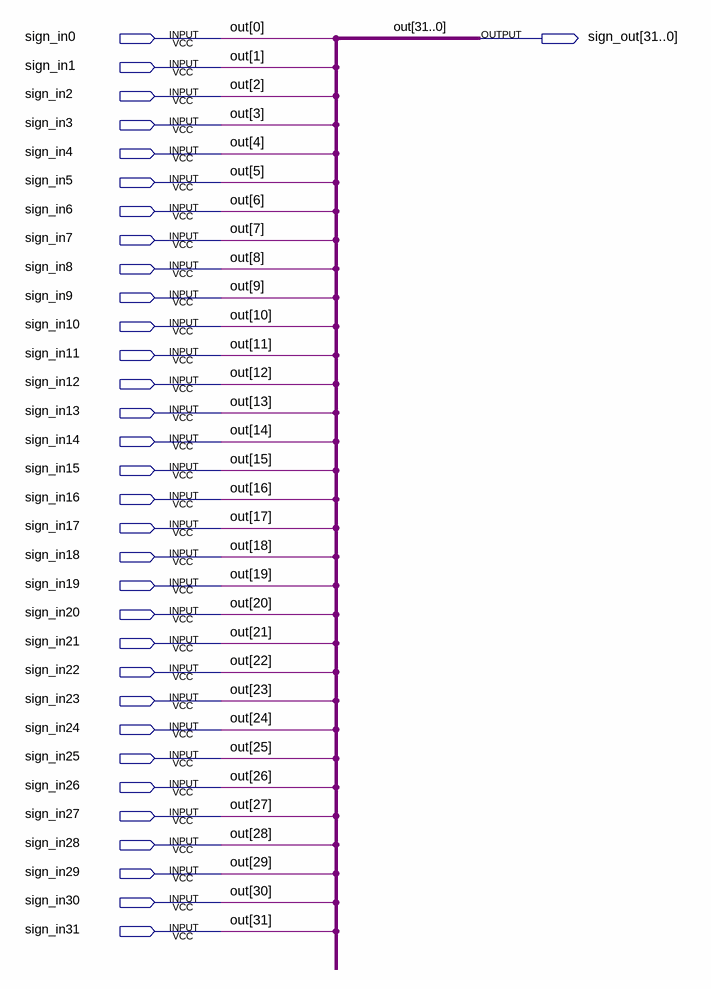
[diagram p0: schematic sheet]
// Quartus schematic sign_ext_helper2.bdf as structural Verilog: 0 symbols, 33 pins
module sign_ext_helper2 (
  input  sign_in0,
  input  sign_in1,
  input  sign_in2,
  input  sign_in3,
  input  sign_in4,
  input  sign_in5,
  input  sign_in6,
  input  sign_in7,
  input  sign_in8,
  input  sign_in9,
  input  sign_in10,
  input  sign_in11,
  input  sign_in12,
  input  sign_in13,
  input  sign_in14,
  input  sign_in15,
  input  sign_in16,
  input  sign_in17,
  input  sign_in18,
  input  sign_in19,
  input  sign_in20,
  input  sign_in21,
  input  sign_in22,
  input  sign_in23,
  input  sign_in24,
  input  sign_in25,
  input  sign_in26,
  input  sign_in27,
  input  sign_in28,
  input  sign_in29,
  input  sign_in30,
  input  sign_in31,
  output [31:0] sign_out
);


  assign sign_out = {sign_in31, sign_in30, sign_in29, sign_in28, sign_in27, sign_in26, sign_in25, sign_in24, sign_in23, sign_in22, sign_in21, sign_in20, sign_in19, sign_in18, sign_in17, sign_in16, sign_in15, sign_in14, sign_in13, sign_in12, sign_in11, sign_in10, sign_in9, sign_in8, sign_in7, sign_in6, sign_in5, sign_in4, sign_in3, sign_in2, sign_in1, sign_in0};

  // Other names for the same wires on the sheet: out[31:0] = {sign_in31, sign_in30, sign_in29, sign_in28, sign_in27, sign_in26, sign_in25, sign_in24, sign_in23, sign_in22, sign_in21, sign_in20, sign_in19, sign_in18, sign_in17, sign_in16, sign_in15, sign_in14, sign_in13, sign_in12, sign_in11, sign_in10, sign_in9, sign_in8, sign_in7, sign_in6, sign_in5, sign_in4, sign_in3, sign_in2, sign_in1, sign_in0}
endmodule
